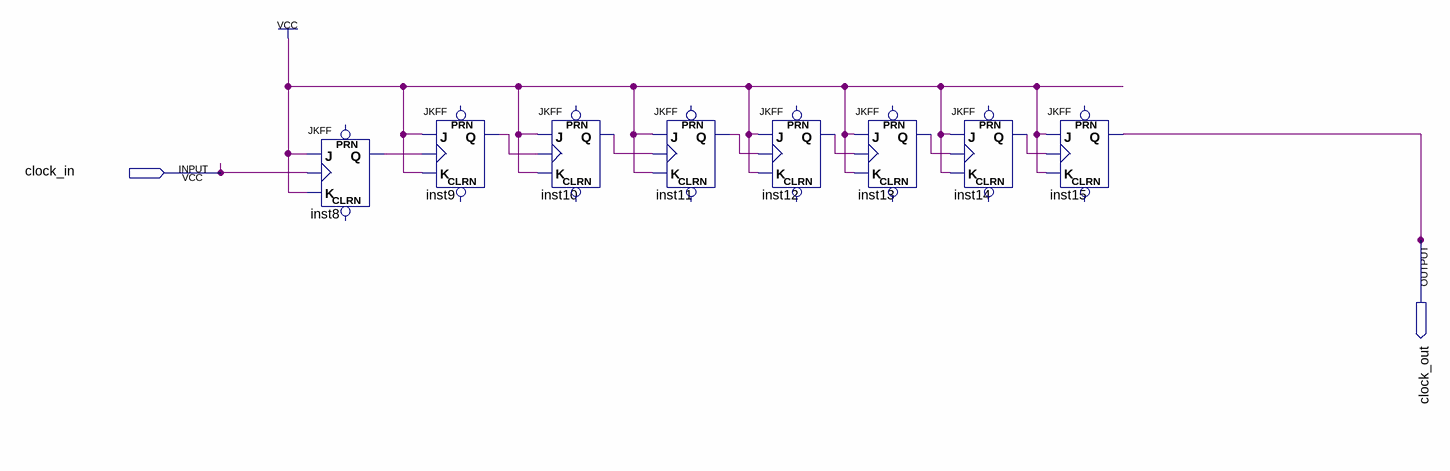
[diagram p0: schematic sheet]
// Quartus schematic Divisor.bdf as structural Verilog: 8 symbols, 2 pins
module Divisor (
  input  clock_in,
  output clock_out
);

  wire inst8_q, inst9_q, inst10_q, inst11_q, inst12_q, inst13_q, inst14_q;

  JKFF inst8 (.K(1'b1), .J(1'b1), .CLK(clock_in), .Q(inst8_q));  // open: PRN, CLRN
  JKFF inst9 (.K(1'b1), .J(1'b1), .CLK(inst8_q), .Q(inst9_q));  // open: PRN, CLRN
  JKFF inst10 (.K(1'b1), .J(1'b1), .CLK(inst9_q), .Q(inst10_q));  // open: PRN, CLRN
  JKFF inst11 (.K(1'b1), .J(1'b1), .CLK(inst10_q), .Q(inst11_q));  // open: PRN, CLRN
  JKFF inst12 (.K(1'b1), .J(1'b1), .CLK(inst11_q), .Q(inst12_q));  // open: PRN, CLRN
  JKFF inst13 (.K(1'b1), .J(1'b1), .CLK(inst12_q), .Q(inst13_q));  // open: PRN, CLRN
  JKFF inst14 (.K(1'b1), .J(1'b1), .CLK(inst13_q), .Q(inst14_q));  // open: PRN, CLRN
  JKFF inst15 (.K(1'b1), .J(1'b1), .CLK(inst14_q), .Q(clock_out));  // open: PRN, CLRN
endmodule
